# EAGLE schematic Breakout Module (EAGLE 6.1)
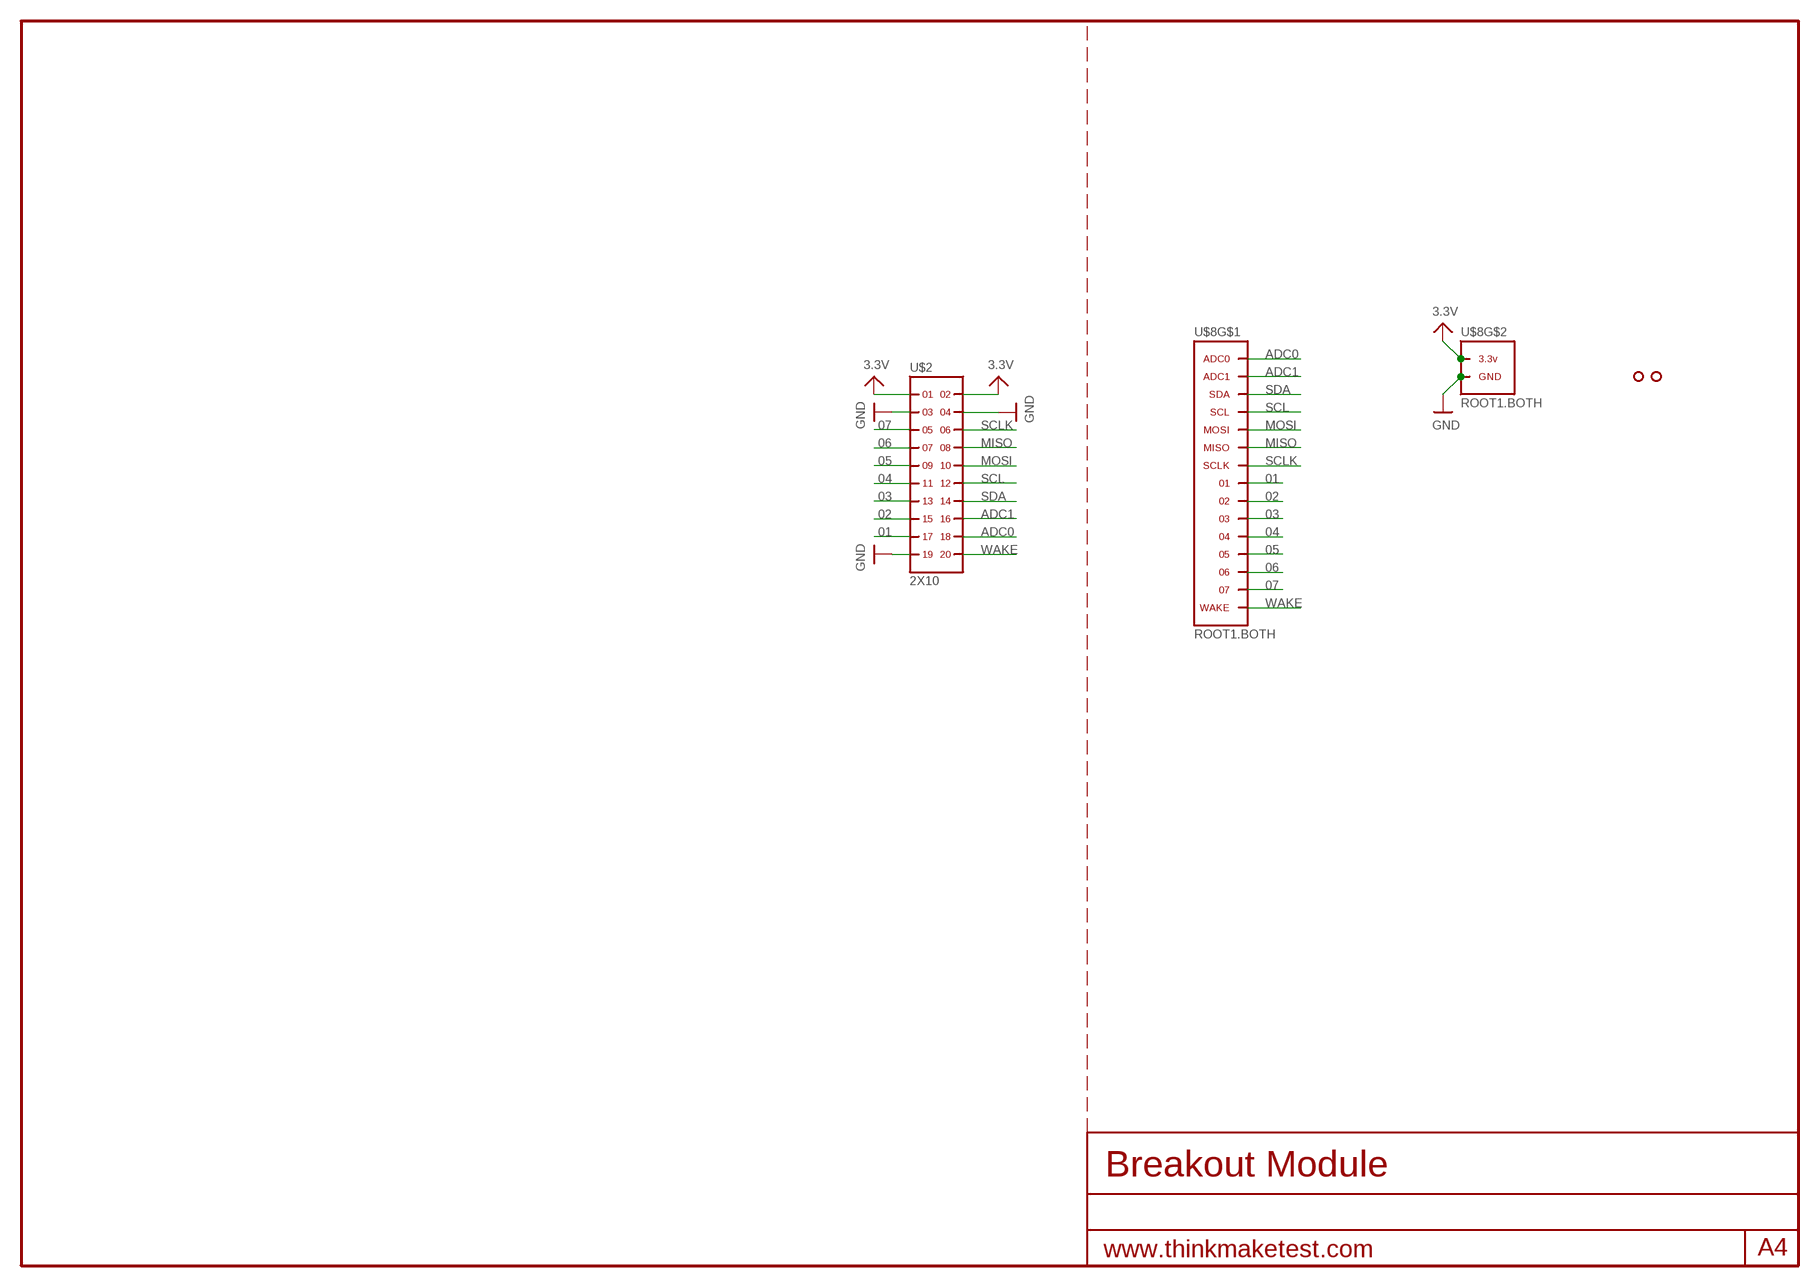
[diagram p0: schematic, sheet 1]

## Parts
U$2  2X10  [2X10]
U$3  HOLE.2MM  [2MM]
U$4  HOLE.2MM  [2MM]
U$8  ROOT1.BOTH  [ROOT1.BOTH]

## Nets
01: U$2.17 U$8.01 U$8.01@1 U$8.01@VIA
02: U$2.15 U$8.02 U$8.02@1 U$8.02@VIA
03: U$2.13 U$8.03 U$8.03@1 U$8.03@VIA
3.3V: U$2.1 U$2.2 U$8.3.3V@1(3.3V) U$8.3.3V@2(3.3V) U$8.3.3V@3(3.3V) U$8.3.3V@4(3.3V) U$8.3.3V@5(3.3V) U$8.3.3V@6(3.3V) U$8.3.3V@7(3.3V) U$8.3.3V@8(3.3V) U$8.3.3V@9(3.3V) U$8.3.3V@10(3.3V) U$8.3.3V@VIA(3.3V)
04: U$2.11 U$8.04 U$8.04@1 U$8.04@VIA
05: U$2.9 U$8.05 U$8.05@1 U$8.05@VIA
06: U$2.7 U$8.06 U$8.06@1 U$8.06@VIA
07: U$2.5 U$8.07 U$8.07@1 U$8.07@VIA
ADC0: U$2.18 U$8.ADC0 U$8.ADC0@1(ADC0) U$8.ADC0@VIA(ADC0)
ADC1: U$2.16 U$8.ADC1 U$8.ADC1@1(ADC1) U$8.ADC1@VIA(ADC1)
GND: U$2.3 U$2.4 U$2.19 U$8.GND@1(GND) U$8.GND@2(GND) U$8.GND@3(GND) U$8.GND@4(GND) U$8.GND@5(GND) U$8.GND@6(GND) U$8.GND@7(GND) U$8.GND@8(GND) U$8.GND@9(GND) U$8.GND@10(GND) U$8.GND@11(GND) U$8.GND@12(GND) U$8.GND@13(GND) U$8.GND@14(GND) U$8.GND@15(GND) U$8.GND@16(GND) U$8.GND@17(GND) U$8.GND@18(GND) U$8.GND@19(GND) U$8.GND@20(GND) U$8.GND@VIA(GND)
MISO: U$2.8 U$8.MISO U$8.MISO@1(MISO) U$8.MISO@VIA(MISO)
MOSI: U$2.10 U$8.MOSI U$8.MOSI@1(MOSI) U$8.MOSI@VIA(MOSI)
SCL: U$2.12 U$8.SCL U$8.SCL@1(SCL) U$8.SCL@VIA(SCL)
SCLK: U$2.6 U$8.SCLK U$8.SCLK@1(SCLK) U$8.SCLK@VIA(SCLK)
SDA: U$2.14 U$8.SDA U$8.SDA@1(SDA) U$8.SDA@VIA(SDA)
WAKE: U$2.20 U$8.WAKE U$8.WAKE@1(WAKE) U$8.WAKE@VIA(WAKE)

## Library data of the parts
U$2 = .headers(.1in):2X10
U$3 U$4 = .screw_holes:HOLE
U$8 = thinkmaketest:ROOT1